# EAGLE board v0a (EAGLE 9.3.0)
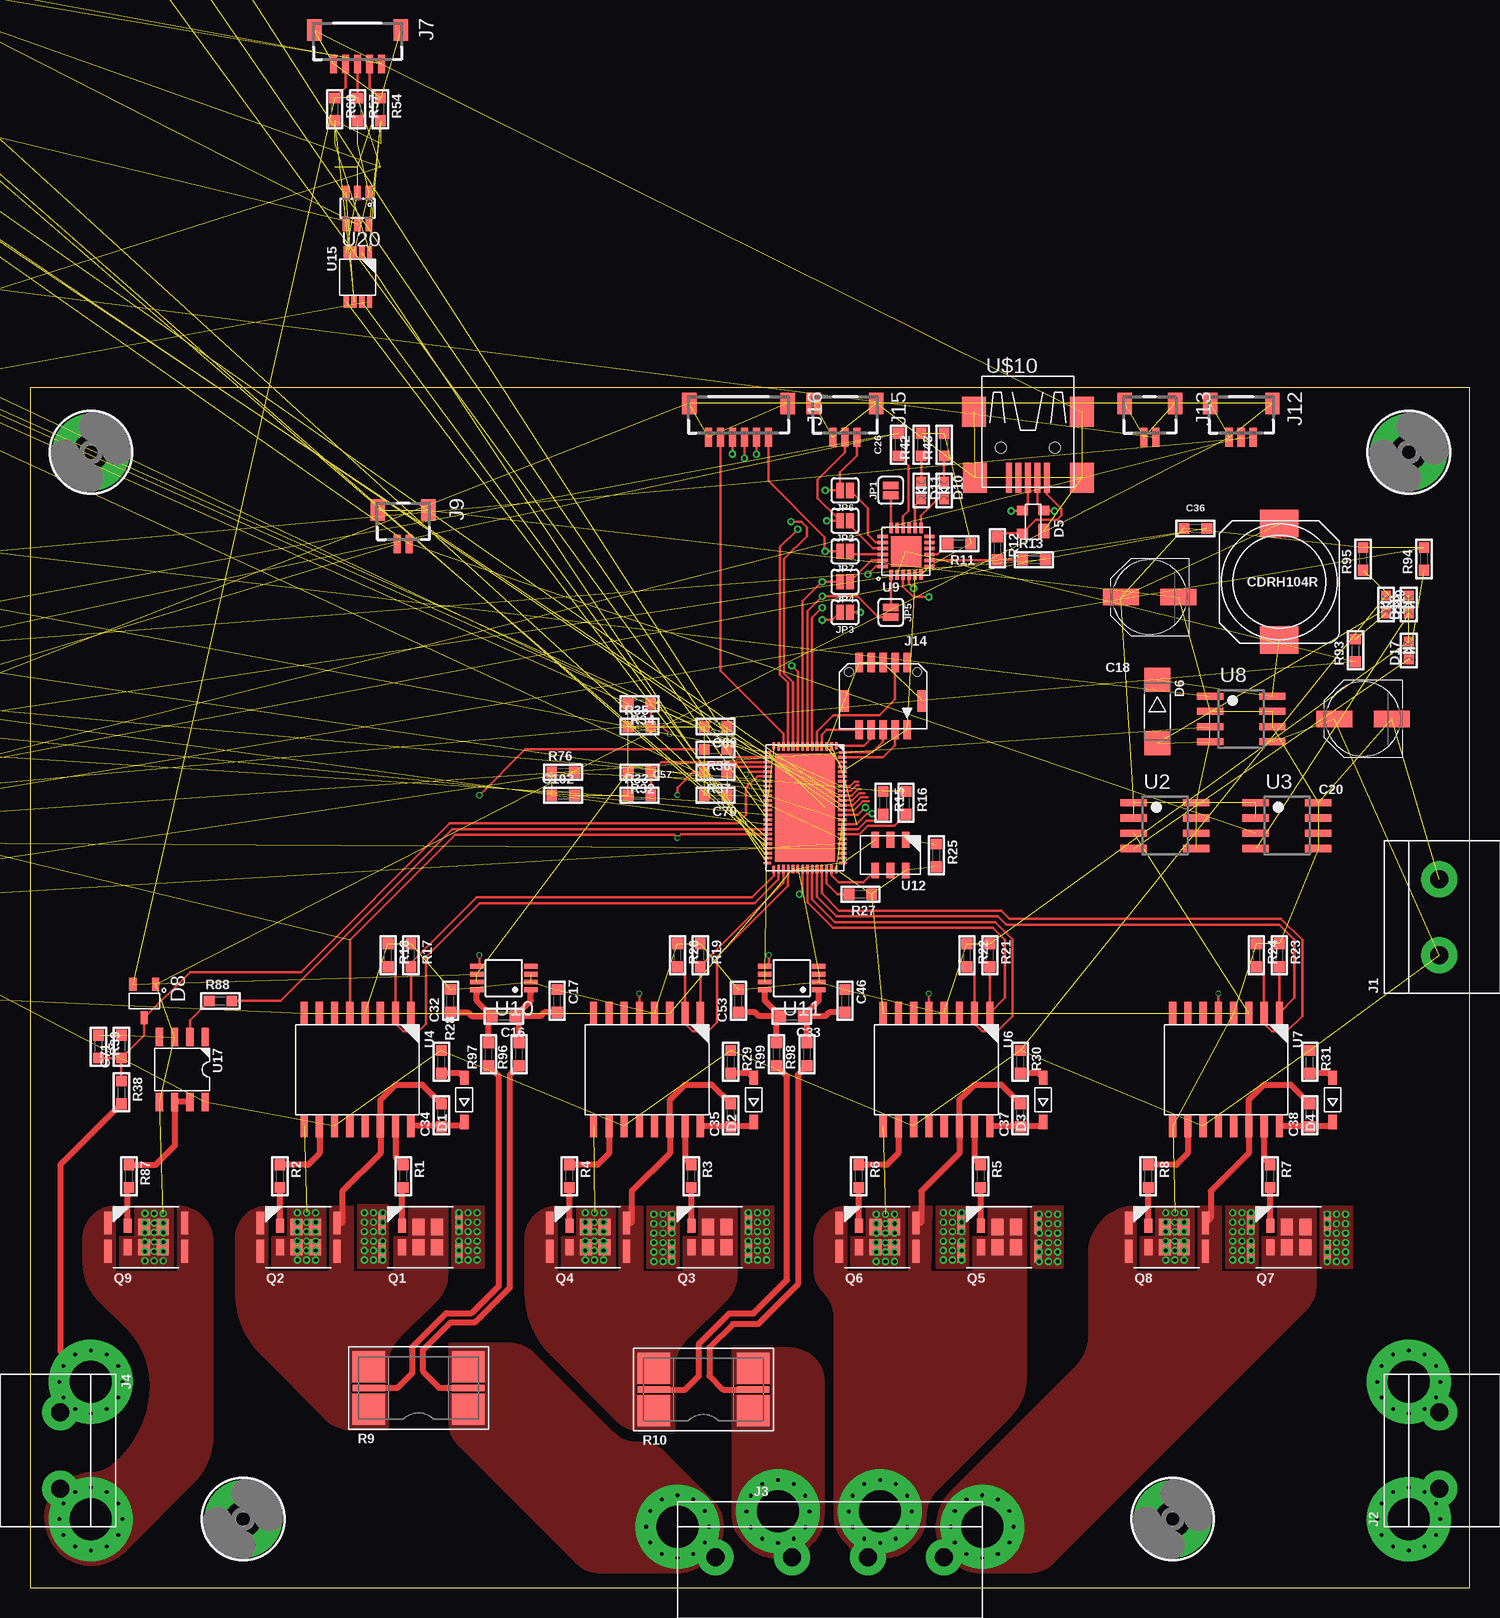
[diagram p5: board, top side]
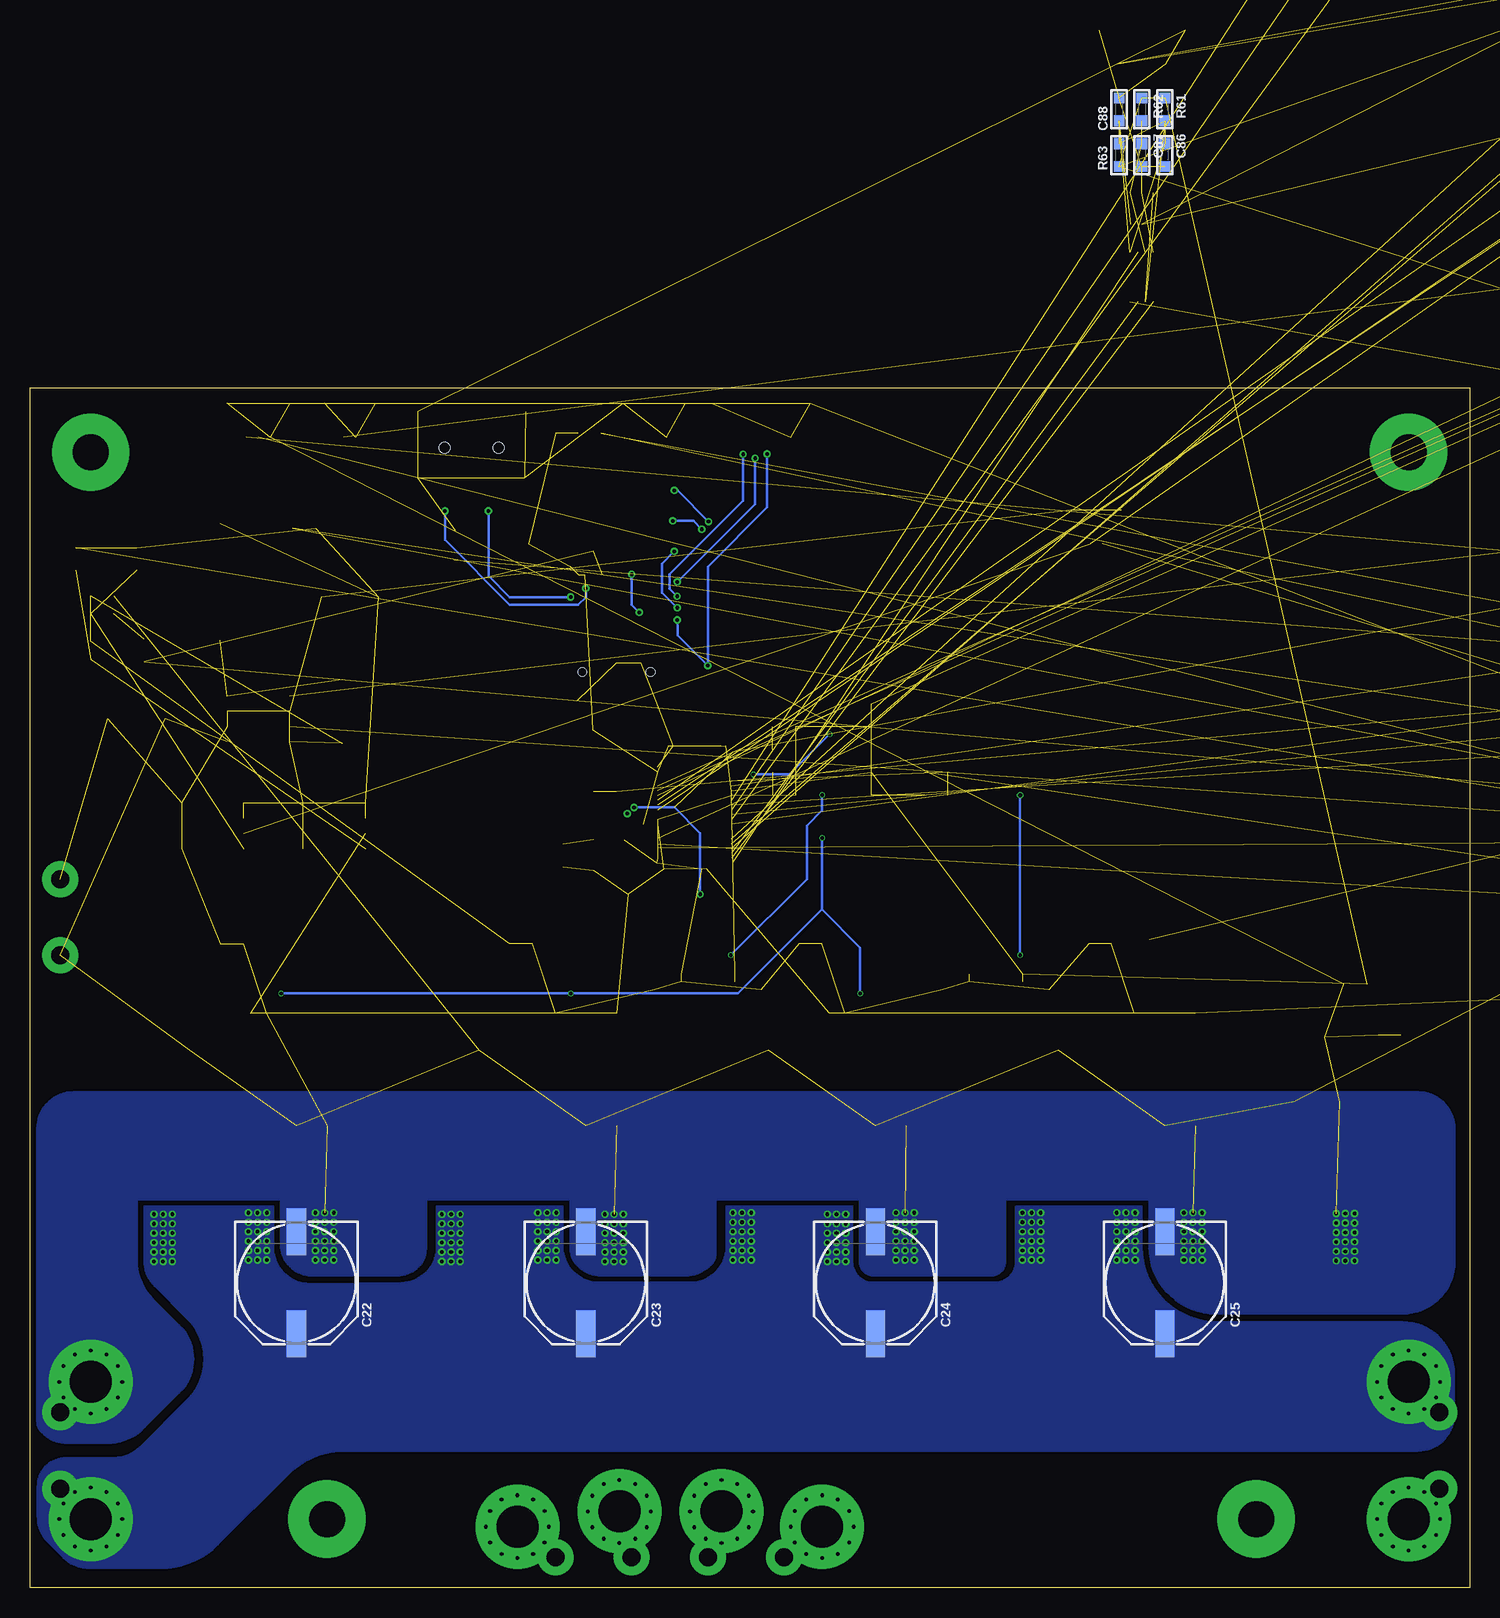
[diagram p6: board, bottom side, seen from below]

Size 120 x 100 mm. Coordinates in mm from the lower left corner, seen from the top.
Outline: 0,0 120,0 120,100 0,100 0,0
Copper layers (1*16): Top 0.035mm / dielectric 1.5mm / Bottom 0.035mm
Design rules "mask_vias *": minimum track width 5mil, minimum drill 0.3mm, track to track 5mil, track to pad 5mil, pad to pad 5mil, via to via 5mil, smd to smd 5mil, copper to edge 0.4mm, drill to drill 5mil, minimum pad ring 3mil, minimum via ring 3mil, stop-mask expansion 4mil, vias tented up to drill 0.8mm, thermal gap 10mil

## Footprints (pad centres in the part's own frame; a part is rotated, then mirrored left to right if it is on the bottom)
0603_WAVE = smd 0.9 x 0.9: P$1 -0.95,0; P$2 0.95,0
PANASONIC_D = smd 3 x 1.4: + 2.4,0; - -2.4,0
PANASONIC_G = smd 3.9 x 1.6: + 4.25,0; - -4.25,0
SOD-123 = smd 1.2 x 0.7: A 1.85,0; C -1.85,0
SOT143 = smd 1.2 x 0.9: 1 -0.711,-0.889 | smd 0.8 x 0.9: 2 0.989,-0.889; 3 0.989,0.911; 4 -0.911,0.911
DO214AA = smd 2 x 2.2: A 2.65,0; C -2.65,0
SOT-23-3 = smd 0.6 x 1.1: P$1 -0.95,-1.4; P$2 0.95,-1.4; P$3 0,1.4
CHIPLED_0603 = smd 0.8 x 0.8: A 0,-0.75; C 0,0.75
2P-6.35P = drill 1.5 pad 3: 1 -3.175,0; 2 3.175,0
4P-6.35P = drill 1.5 pad 3: 1 -9.525,0; 2 -3.175,0; 3 3.175,0; 4 9.525,0
SM05B-SSR-H-TB = smd 0.6 x 1.55: 1 -2,1.925; 2 -1,1.925; 3 0,1.925; 4 1,1.925; 5 2,1.925 | smd 1.2 x 1.8: FIT@1 -3.6,-0.9; FIT@2 3.6,-0.9
SM02B-SSR-H-TB = smd 0.6 x 1.55: 1 -0.5,1.925; 2 0.5,1.925 | smd 1.2 x 1.8: FIT@1 -2.1,-0.9; FIT@2 2.1,-0.9
SM03B-SSR-H-TB = smd 0.6 x 1.55: 1 -1,1.925; 2 0,1.925; 3 1,1.925 | smd 1.2 x 1.8: FIT@1 -2.6,-0.9; FIT@2 2.6,-0.9
F20F-10DP-1V = smd 0.6 x 1.6: 1 -2,2.8; 2 -2,-2.8; 3 -1,2.8; 4 -1,-2.8; 5 0,2.8; 6 0,-2.8; 7 1,2.8; 8 1,-2.8; 9 2,2.8; 10 2,-2.8 | smd 0.85 x 1.8: TAB1 -3.275,0.4; TAB2 3.275,0.4 | hole 0.7: -2.85,-2.005; 2.85,-2.005
SM06B-SSR-H-TB = smd 0.6 x 1.55: 1 -2.5,1.925; 2 -1.5,1.925; 3 -0.5,1.925; 4 0.5,1.925; 5 1.5,1.925; 6 2.5,1.925 | smd 1.2 x 1.8: FIT@1 -4.1,-0.9; FIT@2 4.1,-0.9
SMT-JUMPER_2_NC_PASTE_SILK = smd 0.635 x 1.27: 1 -0.406,0; 2 0.406,0
SMT-JUMPER_2_NO_SILK = smd 0.635 x 1.27: 1 -0.406,0; 2 0.406,0
CDRH104R = smd 3.2 x 2.3: 1 0,-4.85; 2 0,4.85
TH-HP = drill 0.3: H1 2.625,0; H2 2.273,1.312; H3 1.312,2.273; H4 0,2.625; H5 -1.312,2.273; H6 -2.273,1.312; H7 -2.625,0; H8 -2.273,-1.312; H9 -1.312,-2.273; H10 0,-2.625; H11 1.312,-2.273; H12 2.273,-1.312 | drill 3.5 pad 7: PAD 0,0
DIRECTFET-ME = smd 0.6 x 1.9: D1 -3.025,1.175; D2 -3.025,-1.175; D3 3.375,-1.175; D4 3.375,1.175 | smd 0.65 x 1.15: G -1.375,0.95 | smd 0.65 x 1.35: S1 -1.375,-0.85 | smd 1 x 1.35: S2 0,-0.85; S3 1.55,-0.85; S4 1.55,0.85; S5 0,0.85
3920 = smd 2.7 x 2.592: 1 -4.15,1.778; 2 -4.15,-1.778; 3 4.15,-1.778; 4 4.15,1.778 | smd 2.7 x 0.508: SENSE+ -4.15,0; SENSE- 4.15,0
QFN76 = smd 0.6 x 0.225: 1 -5.15,2.6; 14 -5.15,-2.6; 39 5.15,-2.6; 52 5.15,2.6 | smd 0.7 x 0.225: 2 -5.1,2.2; 3 -5.1,1.8; 4 -5.1,1.4; 5 -5.1,1; 6 -5.1,0.6; 7 -5.1,0.2; 8 -5.1,-0.2; 9 -5.1,-0.6; 10 -5.1,-1; 11 -5.1,-1.4; 12 -5.1,-1.8; 13 -5.1,-2.2; 40 5.1,-2.2; 41 5.1,-1.8; 42 5.1,-1.4; 43 5.1,-1; 44 5.1,-0.6; 45 5.1,-0.2; 46 5.1,0.2; 47 5.1,0.6; 48 5.1,1; 49 5.1,1.4; 50 5.1,1.8; 51 5.1,2.2 | smd 0.225 x 0.6: 15 -4.6,-3.15; 38 4.6,-3.15; 53 4.6,3.15; 76 -4.6,3.15 | smd 0.225 x 0.7: 16 -4.2,-3.1; 17 -3.8,-3.1; 18 -3.4,-3.1; 19 -3,-3.1; 20 -2.6,-3.1; 21 -2.2,-3.1; 22 -1.8,-3.1; 23 -1.4,-3.1; 24 -1,-3.1; 25 -0.6,-3.1; 26 -0.2,-3.1; 27 0.2,-3.1; 28 0.6,-3.1; 29 1,-3.1; 30 1.4,-3.1; 31 1.8,-3.1; 32 2.2,-3.1; 33 2.6,-3.1; 34 3,-3.1; 35 3.4,-3.1; 36 3.8,-3.1; 37 4.2,-3.1; 54 4.2,3.1; 55 3.8,3.1; 56 3.4,3.1; 57 3,3.1; 58 2.6,3.1; 59 2.2,3.1; 60 1.8,3.1; 61 1.4,3.1; 62 1,3.1; 63 0.6,3.1; 64 0.2,3.1; 65 -0.2,3.1; 66 -0.6,3.1; 67 -1,3.1; 68 -1.4,3.1; 69 -1.8,3.1; 70 -2.2,3.1; 71 -2.6,3.1; 72 -3,3.1; 73 -3.4,3.1; 74 -3.8,3.1; 75 -4.2,3.1 | smd 9 x 5: PAD 0,0
SOIC8 = smd 0.6 x 2.2: 1 -1.905,-2.6; 2 -0.635,-2.6; 3 0.635,-2.6; 4 1.905,-2.6; 5 1.905,2.6; 6 0.635,2.6; 7 -0.635,2.6; 8 -1.905,2.6
SOIC-16-WB = smd 0.6 x 1.9: 1 -4.445,-4.7; 2 -3.175,-4.7; 3 -1.905,-4.7; 4 -0.635,-4.7; 5 0.635,-4.7; 6 1.905,-4.7; 7 3.175,-4.7; 8 4.445,-4.7; 9 4.445,4.7; 10 3.175,4.7; 11 1.905,4.7; 12 0.635,4.7; 13 -0.635,4.7; 14 -1.905,4.7; 15 -3.175,4.7; 16 -4.445,4.7
QFN24 = smd 0.3 x 0.85: 1 -1.25,-1.95; 2 -0.75,-1.95; 3 -0.25,-1.95; 4 0.25,-1.95; 5 0.75,-1.95; 6 1.25,-1.95; 13 1.25,1.95; 14 0.75,1.95; 15 0.25,1.95; 16 -0.25,1.95; 17 -0.75,1.95; 18 -1.25,1.95 | smd 0.85 x 0.3: 7 1.95,-1.25; 8 1.95,-0.75; 9 1.95,-0.25; 10 1.95,0.25; 11 1.95,0.75; 12 1.95,1.25; 19 -1.95,1.25; 20 -1.95,0.75; 21 -1.95,0.25; 22 -1.95,-0.25; 23 -1.95,-0.75; 24 -1.95,-1.25 | smd 2.55 x 2.55: PAD 0,0
MSOP-8 = smd 0.4 x 1.1: 1 -0.975,-2.25; 2 -0.325,-2.25; 3 0.325,-2.25; 4 0.975,-2.25; 5 0.975,2.25; 6 0.325,2.25; 7 -0.325,2.25; 8 -0.975,2.25
CDFN_5X3.2 = smd 1.3 x 0.64: 1 -1.277,1.27; 2 -1.277,0; 3 -1.277,-1.27; 4 1.277,-1.27; 5 1.277,0; 6 1.277,1.27
TSSOP-8 = smd 0.45 x 1: 1 -1.005,-2.081; 2 -0.355,-2.081; 3 0.295,-2.081; 4 0.945,-2.081; 5 0.945,2.081; 6 0.295,2.081; 7 -0.355,2.081; 8 -1.005,2.081
SOIC_8 = smd 0.6 x 1.55: 1 -1.905,-2.7; 2 -0.635,-2.7; 3 0.635,-2.7; 4 1.905,-2.7; 5 1.905,2.7; 6 0.635,2.7; 7 -0.635,2.7; 8 -1.905,2.7
SOT23-6 = smd 0.55 x 1.2: 1 -0.95,-1.3; 2 0,-1.3; 3 0.95,-1.3; 4 0.95,1.3; 5 0,1.3; 6 -0.95,1.3
USB-M-S1 = smd 2.5 x 0.5: D+ 2.75,0; D- 2.75,0.8; GND 2.75,-1.6; ID 2.75,-0.8; VBUS 2.75,1.6 | smd 2.5 x 2: GND@1 -2.75,-4.5; GND@2 -2.75,4.5; GND@3 2.75,-4.4; GND@4 2.75,4.5 | hole 0.9: 0.25,2.25; 0.25,-2.25
MOUNTINGHOLE_3.0_PLATED = drill 3 pad 6.452: P$1 0,0

## Placement (x,y rotation side)
C1  [0603_WAVE]  not placed on the board
C2  [0603_WAVE]  not placed on the board
C3  [0603_WAVE]  not placed on the board
C4  [0603_WAVE]  not placed on the board
C5  [0603_WAVE]  not placed on the board
C6  [0603_WAVE]  not placed on the board
C7  [0603_WAVE]  not placed on the board
C8  [0603_WAVE]  not placed on the board
C9  100n  [0603_WAVE]  not placed on the board
C10  100n  [0603_WAVE]  not placed on the board
C11  470n  [0603_WAVE]  not placed on the board
C12  4u7  [0603_WAVE]  not placed on the board
C13  [0603_WAVE]  not placed on the board
C14  4u7  [0603_WAVE]  not placed on the board
C15  4u7  [0603_WAVE]  not placed on the board
C16  100n  [0603_WAVE]  39.5,47.62 180 top
C17  100n  [0603_WAVE]  43.94,48.9 270 top
C18  100u  [PANASONIC_D]  93.34,82.55 180 top
C19  10u 25v  [0603_WAVE]  not placed on the board
C20  100u  [PANASONIC_D]  111.12,72.39 180 top
C21  4u7  [0603_WAVE]  not placed on the board
C22  330u  [PANASONIC_G]  97.79,25.4 270 bottom
C23  330u  [PANASONIC_G]  73.66,25.4 270 bottom
C24  330u  [PANASONIC_G]  49.53,25.4 270 bottom
C25  330u  [PANASONIC_G]  25.4,25.4 270 bottom
C26  4u7  [0603_WAVE]  72.39,95.25 90 top
C27  100n 25v  [0603_WAVE]  not placed on the board
C28  100n  [0603_WAVE]  not placed on the board
C29  100n  [0603_WAVE]  not placed on the board
C30  4u7  [0603_WAVE]  not placed on the board
C31  [0603_WAVE]  not placed on the board
C32  100n  [0603_WAVE]  35.05,48.9 90 top
C33  100n  [0603_WAVE]  63.5,47.62 180 top
C34  220n 25v  [0603_WAVE]  34.29,39.37 90 top
C35  220n 25v  [0603_WAVE]  58.42,39.37 90 top
C36  4u7  [0603_WAVE]  97.16,88.27 0 top
C37  220n 25v  [0603_WAVE]  82.55,39.37 90 top
C38  220n 25v  [0603_WAVE]  106.68,39.37 90 top
C39  10u 25v  [0603_WAVE]  not placed on the board
C40  100n  [0603_WAVE]  not placed on the board
C41  100n  [0603_WAVE]  not placed on the board
C42  100n  [0603_WAVE]  not placed on the board
C43  10u 25v  [0603_WAVE]  not placed on the board
C44  10u 25v  [0603_WAVE]  not placed on the board
C45  4u7  [0603_WAVE]  not placed on the board
C46  100n  [0603_WAVE]  67.94,48.9 270 top
C47  100n  [0603_WAVE]  not placed on the board
C48  100n 25v  [0603_WAVE]  not placed on the board
C49  100n 25v  [0603_WAVE]  not placed on the board
C50  10u 25v  [0603_WAVE]  not placed on the board
C51  10u 25v  [0603_WAVE]  not placed on the board
C52  4u7  [0603_WAVE]  not placed on the board
C53  100n  [0603_WAVE]  59.05,48.9 90 top
C54  100n  [0603_WAVE]  not placed on the board
C55  100n 25v  [0603_WAVE]  not placed on the board
C56  100n 25v  [0603_WAVE]  not placed on the board
C57  10u 25v  [0603_WAVE]  not placed on the board
C58  10u 25v  [0603_WAVE]  not placed on the board
C59  4u7  [0603_WAVE]  not placed on the board
C61  100n  [0603_WAVE]  not placed on the board
C62  100n 25v  [0603_WAVE]  not placed on the board
C63  100n 25v  [0603_WAVE]  not placed on the board
C64  10u 25v  [0603_WAVE]  not placed on the board
C66  4u7  [0603_WAVE]  not placed on the board
C67  100n  [0603_WAVE]  not placed on the board
C68  100n  [0603_WAVE]  not placed on the board
C69  100p  [0603_WAVE]  57.15,71.75 180 top
C70  100p  [0603_WAVE]  57.15,66.04 180 top
C71  10n  [0603_WAVE]  7.62,45.09 90 top
C76  100p  [0603_WAVE]  not placed on the board
C77  100p  [0603_WAVE]  not placed on the board
C78  [0603_WAVE]  not placed on the board
C79  [0603_WAVE]  not placed on the board
C80  [0603_WAVE]  not placed on the board
C81  [0603_WAVE]  not placed on the board
C82  [0603_WAVE]  not placed on the board
C83  [0603_WAVE]  not placed on the board
C84  [0603_WAVE]  not placed on the board
C85  1u  [0603_WAVE]  not placed on the board
C86  [0603_WAVE]  not placed on the board
C87  [0603_WAVE]  not placed on the board
C88  [0603_WAVE]  not placed on the board
C89  [0603_WAVE]  not placed on the board
C90  100n  [0603_WAVE]  not placed on the board
C91  100n  [0603_WAVE]  not placed on the board
C92  100n  [0603_WAVE]  not placed on the board
C93  100n  [0603_WAVE]  not placed on the board
C94  100n  [0603_WAVE]  not placed on the board
C95  100n  [0603_WAVE]  not placed on the board
C96  [0603_WAVE]  not placed on the board
C97  [0603_WAVE]  not placed on the board
C98  [0603_WAVE]  not placed on the board
C99  [0603_WAVE]  not placed on the board
C100  100n  [0603_WAVE]  not placed on the board
C101  100n  [0603_WAVE]  not placed on the board
C102  100p  [0603_WAVE]  44.45,66.04 0 top
C103  100p  [0603_WAVE]  not placed on the board
C104  [0603_WAVE]  not placed on the board
C105  [0603_WAVE]  not placed on the board
C106  [0603_WAVE]  not placed on the board
C107  [0603_WAVE]  not placed on the board
D1  DSK24  [SOD-123]  36.2,40.64 90 top
D2  DSK24  [SOD-123]  60.33,40.64 90 top
D3  DSK24  [SOD-123]  84.45,40.64 90 top
D4  DSK24  [SOD-123]  108.58,40.64 90 top
D5  SP0503BAHT  [SOT143]  83.63,88.77 90 top
D6  SK54L  [DO214AA]  93.98,73.03 270 top
D8  BAT54S  [SOT-23-3]  9.53,48.9 180 top
D9  BAT54S  [SOT-23-3]  not placed on the board
D10  [CHIPLED_0603]  76.2,91.44 180 top
D11  [CHIPLED_0603]  74.3,91.44 180 top
D12  BAT54S  [SOT-23-3]  not placed on the board
D13  BAT54S  [SOT-23-3]  not placed on the board
D14  BAT54S  [SOT-23-3]  not placed on the board
D15  BAT54S  [SOT-23-3]  not placed on the board
D16  BAT54S  [SOT-23-3]  not placed on the board
D17  [CHIPLED_0603]  114.94,78.11 0 top
D18  [CHIPLED_0603]  114.94,81.92 0 top
D19  [CHIPLED_0603]  113.03,81.92 180 top
J1  2P-6.35P  [2P-6.35P]  117.47,55.88 90 top
J2  2P-6.35P  [2P-6.35P]  117.47,11.43 90 top
J3  4P-6.35P  [4P-6.35P]  66.67,2.54 0 top
J4  2P-6.35P  [2P-6.35P]  2.54,11.43 270 top
J5  SH-5  [SM05B-SSR-H-TB]  not placed on the board
J6  SH-5  [SM05B-SSR-H-TB]  not placed on the board
J7  SH-5  [SM05B-SSR-H-TB]  27.3,128.91 180 top  (outside the outline)
J8  SH-5  [SM05B-SSR-H-TB]  not placed on the board
J9  SH-2  [SM02B-SSR-H-TB]  31.11,88.9 180 top
J10  SH-5  [SM05B-SSR-H-TB]  not placed on the board
J12  SH-3  [SM03B-SSR-H-TB]  100.97,97.79 180 top
J13  SH-2  [SM02B-SSR-H-TB]  93.34,97.79 180 top
J14  F20F-10DP-1V  [F20F-10DP-1V]  71.12,74.3 180 top
J15  SH-3  [SM03B-SSR-H-TB]  67.94,97.79 180 top
J16  SH-6  [SM06B-SSR-H-TB]  59.05,97.79 180 top
JP1  JUMPER-SMT_2_NC_PASTE_SILK  [SMT-JUMPER_2_NC_PASTE_SILK]  71.75,91.44 90 top
JP2  JUMPER-SMT_2_NO_SILK  [SMT-JUMPER_2_NO_SILK]  67.94,88.9 180 top
JP3  JUMPER-SMT_2_NC_PASTE_SILK  [SMT-JUMPER_2_NC_PASTE_SILK]  67.94,81.28 180 top
JP4  JUMPER-SMT_2_NC_PASTE_SILK  [SMT-JUMPER_2_NC_PASTE_SILK]  67.94,83.82 180 top
JP5  JUMPER-SMT_2_NC_PASTE_SILK  [SMT-JUMPER_2_NC_PASTE_SILK]  71.75,81.28 270 top
JP6  JUMPER-SMT_2_NO_SILK  [SMT-JUMPER_2_NO_SILK]  67.94,91.44 180 top
JP7  JUMPER-SMT_2_NC_PASTE_SILK  [SMT-JUMPER_2_NC_PASTE_SILK]  67.94,86.36 180 top
L2  68uH  [CDRH104R]  104.14,83.82 0 top
P1  POWPAD  [TH-HP]  53.98,5.08 90 top
P2  POWPAD  [TH-HP]  62.36,6.35 90 top
P3  POWPAD  [TH-HP]  70.87,6.35 90 top
P4  POWPAD  [TH-HP]  79.38,5.08 90 top
P5  POWPAD  [TH-HP]  114.94,17.14 0 top
P6  POWPAD  [TH-HP]  114.94,5.71 0 top
P7  POWPAD  [TH-HP]  5.08,17.14 0 top
P8  POWPAD  [TH-HP]  5.08,5.71 0 top
Q1  IRF7580  [DIRECTFET-ME]  32.38,29.21 0 top
Q2  IRF7580  [DIRECTFET-ME]  22.23,29.21 0 top
Q3  IRF7580  [DIRECTFET-ME]  56.52,29.21 0 top
Q4  IRF7580  [DIRECTFET-ME]  46.35,29.21 0 top
Q5  IRF7580  [DIRECTFET-ME]  80.64,29.21 0 top
Q6  IRF7580  [DIRECTFET-ME]  70.48,29.21 0 top
Q7  IRF7580  [DIRECTFET-ME]  104.78,29.21 0 top
Q8  IRF7580  [DIRECTFET-ME]  94.61,29.21 0 top
Q9  IRF7580  [DIRECTFET-ME]  9.53,29.21 0 top
R1  2.2  [0603_WAVE]  31.11,34.29 270 top
R2  2.2  [0603_WAVE]  20.83,34.29 270 top
R3  2.2  [0603_WAVE]  55.12,34.29 270 top
R4  2.2  [0603_WAVE]  44.96,34.29 270 top
R5  2.2  [0603_WAVE]  79.25,34.29 270 top
R6  2.2  [0603_WAVE]  69.09,34.29 270 top
R7  2.2  [0603_WAVE]  103.38,34.29 270 top
R8  2.2  [0603_WAVE]  93.22,34.29 270 top
R9  700u  [3920]  32.38,16.64 0 top
R10  700u  [3920]  56.13,16.51 0 top
R11  10k  [0603_WAVE]  77.47,87 180 top
R12  24k  [0603_WAVE]  80.64,86.61 270 top
R13  47k  [0603_WAVE]  83.69,85.66 0 top
R15  10k  [0603_WAVE]  71.12,65.41 270 top
R16  10k  [0603_WAVE]  73.03,65.41 270 top
R17  10k  [0603_WAVE]  31.75,52.7 270 top
R18  10k  [0603_WAVE]  29.84,52.7 270 top
R19  10k  [0603_WAVE]  55.88,52.7 270 top
R20  10k  [0603_WAVE]  53.98,52.7 270 top
R21  10k  [0603_WAVE]  80.01,52.7 270 top
R22  10k  [0603_WAVE]  78.11,52.7 270 top
R23  10k  [0603_WAVE]  104.14,52.7 270 top
R24  10k  [0603_WAVE]  102.23,52.7 270 top
R25  [0603_WAVE]  75.56,61.02 270 top
R26  10k  [0603_WAVE]  not placed on the board
R27  [0603_WAVE]  69.22,57.78 180 top
R28  2.2  [0603_WAVE]  34.29,43.81 270 top
R29  2.2  [0603_WAVE]  58.42,43.81 270 top
R30  2.2  [0603_WAVE]  82.55,43.81 270 top
R31  2.2  [0603_WAVE]  106.68,43.81 270 top
R32  10k  [0603_WAVE]  50.8,67.94 180 top
R33  10k  [0603_WAVE]  50.8,66.04 0 top
R34  10k  [0603_WAVE]  50.8,73.66 180 top
R35  10k  [0603_WAVE]  50.8,71.75 0 top
R36  100  [0603_WAVE]  57.15,69.85 180 top
R37  100  [0603_WAVE]  57.15,67.94 180 top
R38  140k  [0603_WAVE]  7.62,41.27 270 top
R39  10k  [0603_WAVE]  5.71,45.09 270 top
R40  24k  [0603_WAVE]  not placed on the board
R41  24k  [0603_WAVE]  not placed on the board
R42  [0603_WAVE]  74.3,95.25 90 top
R43  [0603_WAVE]  76.2,95.25 90 top
R45  10k  [0603_WAVE]  not placed on the board
R46  10k  [0603_WAVE]  not placed on the board
R47  10k  [0603_WAVE]  not placed on the board
R48  [0603_WAVE]  not placed on the board
R49  [0603_WAVE]  not placed on the board
R50  [0603_WAVE]  not placed on the board
R51  [0603_WAVE]  not placed on the board
R52  [0603_WAVE]  not placed on the board
R53  [0603_WAVE]  not placed on the board
R54  [0603_WAVE]  29.21,123.19 270 top  (outside the outline)
R55  10M  [0603_WAVE]  not placed on the board
R56  10k  [0603_WAVE]  not placed on the board
R57  [0603_WAVE]  27.3,123.19 270 top  (outside the outline)
R58  4.2k  [0603_WAVE]  not placed on the board
R59  1.2k  [0603_WAVE]  not placed on the board
R60  [0603_WAVE]  25.4,123.19 270 top  (outside the outline)
R61  100k  [0603_WAVE]  not placed on the board
R62  100k  [0603_WAVE]  not placed on the board
R63  100k  [0603_WAVE]  not placed on the board
R64  100k  [0603_WAVE]  not placed on the board
R65  100k  [0603_WAVE]  not placed on the board
R66  100k  [0603_WAVE]  not placed on the board
R67  100k  [0603_WAVE]  not placed on the board
R68  100k  [0603_WAVE]  not placed on the board
R69  100k  [0603_WAVE]  not placed on the board
R70  [0603_WAVE]  not placed on the board
R71  [0603_WAVE]  not placed on the board
R72  [0603_WAVE]  not placed on the board
R73  100k  [0603_WAVE]  not placed on the board
R74  100k  [0603_WAVE]  not placed on the board
R75  100k  [0603_WAVE]  not placed on the board
R76  100  [0603_WAVE]  44.45,67.94 0 top
R77  100  [0603_WAVE]  not placed on the board
R78  10k  [0603_WAVE]  not placed on the board
R79  10k  [0603_WAVE]  not placed on the board
R80  10k  [0603_WAVE]  not placed on the board
R81  10k  [0603_WAVE]  not placed on the board
R82  10k  [0603_WAVE]  not placed on the board
R83  10k  [0603_WAVE]  not placed on the board
R84  [0603_WAVE]  not placed on the board
R85  [0603_WAVE]  not placed on the board
R86  [0603_WAVE]  not placed on the board
R87  2.2  [0603_WAVE]  8.26,34.29 270 top
R88  220  [0603_WAVE]  15.88,48.9 0 top
R89  24k  [0603_WAVE]  not placed on the board
R90  24k  [0603_WAVE]  not placed on the board
R91  24k  [0603_WAVE]  not placed on the board
R92  24k  [0603_WAVE]  not placed on the board
R93  2k  [0603_WAVE]  110.49,78.11 90 top
R94  1k  [0603_WAVE]  116.2,85.72 90 top
R95  1k  [0603_WAVE]  111.12,85.72 90 top
R96  [0603_WAVE]  40.77,44.45 90 top
R97  [0603_WAVE]  38.23,44.45 90 top
R98  [0603_WAVE]  64.77,44.45 90 top
R99  [0603_WAVE]  62.23,44.45 90 top
U1  TMC4671  [QFN76]  64.61,65 270 top
U2  MIC39101  [SOIC8]  94.61,63.5 270 top
U3  MIC39101  [SOIC8]  104.78,63.5 270 top
U4  SI82397  [SOIC-16-WB]  27.3,43.18 180 top
U5  SI82397  [SOIC-16-WB]  51.44,43.18 180 top
U6  SI82397  [SOIC-16-WB]  75.56,43.18 180 top
U7  SI82397  [SOIC-16-WB]  99.69,43.18 180 top
U8  MIC4682  [SOIC8]  100.97,72.39 270 top
U9  CP2130/2102N  [QFN24]  73.03,86.36 0 top
U10  AD8418A  [MSOP-8]  39.5,50.8 90 top
U11  AD8418A  [MSOP-8]  63.5,50.8 90 top
U12  DSC1101  [CDFN_5X3.2]  71.73,61.05 270 top
U13  74LVC3G17  [TSSOP-8]  not placed on the board
U14  74LVC3G17  [TSSOP-8]  not placed on the board
U15  74LVC3G17  [TSSOP-8]  not placed on the board
U16  74LVC3G17  [TSSOP-8]  not placed on the board
U17  SI8261  [SOIC_8]  12.7,43.18 180 top
U18  SRV05-4  [SOT23-6]  not placed on the board
U19  SRV05-4  [SOT23-6]  not placed on the board
U20  SRV05-4  [SOT23-6]  not placed on the board
U21  SRV05-4  [SOT23-6]  not placed on the board
U$10  USB-SHIELD  [USB-M-S1]  83.19,95.25 270 top
U$12  MOUNTINGHOLE3.0  [MOUNTINGHOLE_3.0_PLATED]  114.94,94.61 0 top
U$13  MOUNTINGHOLE3.0  [MOUNTINGHOLE_3.0_PLATED]  5.08,94.61 0 top
U$15  MOUNTINGHOLE3.0  [MOUNTINGHOLE_3.0_PLATED]  95.25,5.71 0 top
U$16  MOUNTINGHOLE3.0  [MOUNTINGHOLE_3.0_PLATED]  17.78,5.71 0 top

## Tracks (layer width: path | path; a pad name or v marks a point on that pad's centre or on a via)
1.8V  (via drill 0.3 pad 0.6)  (4 unrouted)
  Top 0.2: U1.45 64.41,58.05 v64.14,57.78 | v69.64,65.01 69.03,64.4 U1.63
  Bottom 0.2: v64.14,57.78 64.14,62.87 66.28,65.01 v69.64,65.01
3.3V  (via drill 0.3 pad 0.6)  (56 unrouted)
  Top 0.2: U1.61 68.88,63.6 69.77,64.49 69.86,64.49 69.88,64.5 v70.2,64.5
5V  (51 unrouted)
12V  (32 unrouted)
!CS  (via drill 0.3 pad 0.6)
  Top 0.2: U1.6 65.2,80.83 v66.04,81.66 | JP7.2 v66.29,86.36 66.25,86.4 66.25,87.53 61.55,92.22 J16.1
  Bottom 0.2: v66.29,86.36 67.31,85.34 67.31,82.91 66.06,81.66 v66.04,81.66
ADC_I0_U_PF  (via drill 0.3, 0.35)
  Top 0.2: R36.P$2 41.27,69.85 v37.47,66.04 | v37.47,52.7 37.47,51.99 U10.5
  Bottom 0.2: v37.47,66.04 v37.47,52.7
ADC_I1_V_PF  (via drill 0.3)
  Top 0.2: R37.P$2 55.24,67.94 53.98,66.67 v53.98,66.04 | v61.59,52.7 61.59,52.12 U11.5
  Bottom 0.2: v53.98,66.04 53.98,64.77 55.24,63.5 55.24,59.05 v61.59,52.7
ADC_T_MOSFETS  (3 unrouted)
ADC_T_MOTOR  (3 unrouted)
AENC_UX_P  (3 unrouted)
AENC_VN_P  (3 unrouted)
AENC_WY_P  (3 unrouted)
BRAKE
  Top 0.2: R88.P$2 20.89,48.9 35.19,63.2 U1.31
CP2102_RX  (via drill 0.3 pad 0.6)
  Top 0.2: J15.2 67.94,94.61 65.66,92.33 65.66,90.78 67.42,89.01 | 67.42,89.01 JP2.2 | v66.42,88.9 67.31,88.9 67.42,89.01 | v64.01,88.2 62.54,86.73 62.54,76.06 63.2,75.4 U1.11
  Bottom 0.2: v66.42,88.9 64.71,88.9 v64.01,88.2
CP2102_TX  (via drill 0.3 pad 0.6)
  Top 0.2: J15.1 68.94,94.34 67.54,92.94 JP6.2 v66.29,91.44 | U1.10 63.6,75.46 62.87,76.2 62.87,85.72 64.77,87.63 64.77,88.38 64.31,88.84 v63.44,88.84
  Bottom 0.2: v66.29,91.44 66.04,91.44 v63.44,88.84
D+  (via drill 0.3 pad 0.6)
  Top 0.2: U$10.D+ 83.19,90.23 D5.3 82.68,89.72 v81.79,89.72 | v74.93,82.55 v74.92,82.56 73.63,82.56 72.78,83.42 U9.3
  Bottom 0.2: v74.93,82.55 80.01,82.55 81.79,84.33 v81.79,89.72
D-  (via drill 0.3 pad 0.6)
  Top 0.2: U$10.D- 83.98,90.3 D5.2 84.56,89.72 v85.41,89.72 | U9.4 73.28,83.66 v73.66,83.28
  Bottom 0.2: v73.66,83.28 73.66,82.55 74.3,81.92 80.01,81.92 85.41,87.31 v85.41,89.72
DBG_SPI_MISO
  Top 0.2: J14.9 66.42,71.5 66,71.08 U1.4
DBG_SPI_MOSI
  Top 0.2: U1.1 69.52,70.15 70.12,70.75 J14.7
DBG_SPI_NSCS
  Top 0.2: U1.75 67.72,69.22 71.12,69.22 72.12,70.22 J14.3
DBG_SPI_SCK
  Top 0.2: U1.76 70.23,69.6 71.12,70.48 J14.5
DBG_SPI_TRG
  Top 0.2: J14.4 72.12,74.03 70.8,72.71 66.99,72.71 65.61,71.32 U1.5
DCBUS  (via drill 0.3 pad 0.6)
  Top 0.508: R38.P$2 2.54,35.24 2.54,19.68 P7.PAD
  other vias: 27.88,31.24 28.64,31.24 29.4,31.24 27.88,30.45 28.64,30.45 29.4,30.45 29.4,29.67 28.64,29.67 27.88,29.67 27.88,28.88 28.64,28.88 29.4,28.88 27.88,28.09 28.64,28.09 29.4,28.09 27.88,27.3 28.64,27.3 29.4,27.3 35.75,31.24 36.51,31.24 37.27,31.24 35.75,30.45 36.51,30.45 37.27,30.45 37.27,29.67 36.51,29.67 35.75,29.67 35.75,28.88 36.51,28.88 37.27,28.88 35.75,28.09 36.51,28.09 37.27,28.09 35.75,27.3 36.51,27.3 37.27,27.3 59.88,31.24 60.64,31.24 61.4,31.24 59.88,30.45 60.64,30.45 61.4,30.45 61.4,29.67 60.64,29.67 59.88,29.67 59.88,28.88 60.64,28.88 61.4,28.88 59.88,28.09 60.64,28.09 61.4,28.09 59.88,27.3 60.64,27.3 61.4,27.3 52.01,31.11 52.77,31.11 53.53,31.11 52.01,30.33 52.77,30.33 53.53,30.33 53.53,29.54 52.77,29.54 52.01,29.54 52.01,28.75 52.77,28.75 53.53,28.75 52.01,27.97 52.77,27.97 53.53,27.97 52.01,27.18 52.77,27.18 53.53,27.18 76.14,31.24 76.9,31.24 77.66,31.24 76.14,30.45 76.9,30.45 77.66,30.45 77.66,29.67 76.9,29.67 76.14,29.67 76.14,28.88 76.9,28.88 77.66,28.88 76.14,28.09 76.9,28.09 77.66,28.09 76.14,27.3 76.9,27.3 77.66,27.3 100.27,31.24 101.03,31.24 101.79,31.24 100.27,30.45 101.03,30.45 101.79,30.45 101.79,29.67 101.03,29.67 100.27,29.67 100.27,28.88 101.03,28.88 101.79,28.88 100.27,28.09 101.03,28.09 101.79,28.09 100.27,27.3 101.03,27.3 101.79,27.3 108.14,31.11 108.9,31.11 109.66,31.11 108.14,30.33 108.9,30.33 109.66,30.33 109.66,29.54 108.9,29.54 108.14,29.54 108.14,28.75 108.9,28.75 109.66,28.75 108.14,27.97 108.9,27.97 109.66,27.97 108.14,27.18 108.9,27.18 109.66,27.18 84.14,31.11 84.9,31.11 85.66,31.11 84.14,30.33 84.9,30.33 85.66,30.33 85.66,29.54 84.9,29.54 84.14,29.54 84.14,28.75 84.9,28.75 85.66,28.75 84.14,27.97 84.9,27.97 85.66,27.97 84.14,27.18 84.9,27.18 85.66,27.18
  pour Top (no thermals): 27.3,31.88 27.3,26.67 29.84,26.67 29.84,31.88
  pour Top (no thermals): 37.85,26.67 37.85,31.75 35.18,31.75 35.18,26.67
  pour Bottom (no thermals): 1.27,14.43 1.27,17.84 arc-90 5.54,22.11 21.01,22.11 arc90 27.3,28.4 27.3,31.75 37.85,31.75 37.85,27.14 arc90 39.57,25.41 49.69,25.39 arc90 51.42,27.13 51.42,31.75 61.98,31.75 61.98,28.4 arc90 64.98,25.4 72.56,25.4 arc90 75.56,28.4 75.56,31.75 86.11,31.75 86.11,28.37 arc89 89.08,25.37 96.67,25.3 arc91 99.69,28.3 99.69,31.75 110.49,31.75 110.49,27.28 arc-45 109.61,25.16 106.88,22.43 arc90 106.88,15.65 110.85,11.67 arc45 112.98,10.79 117.02,10.79 arc-90 119.38,8.43 119.38,5.94 arc-45 118.5,3.82 117.21,2.53 arc-45 115.09,1.65 109.07,1.65 arc-45 104.34,3.61 98.48,9.47 arc45 93.74,11.43 4.27,11.43 arc-90
  pour Top (no thermals): 99.69,31.75 99.69,26.67 102.36,26.67 102.36,31.75
  pour Top (no thermals): 75.56,31.75 75.56,26.67 78.23,26.67 78.23,31.75
  pour Top (no thermals): 61.98,26.67 61.98,31.75 59.31,31.75 59.31,26.67
  pour Top (no thermals): 51.44,31.75 51.44,26.67 54.1,26.67 54.1,31.75
  pour Top (no thermals): 110.24,26.67 110.24,31.75 107.57,31.75 107.57,26.67
  pour Top (no thermals): 86.11,26.67 86.11,31.75 83.44,31.75 83.44,26.67
DIR  (3 unrouted)
ENC2_A  (1 unrouted)
  Top 0.2: 69.94,65.55 69.77,65.55 69.76,65.54 69.42,65.54 68.68,64.8 U1.64
ENC2_B  (1 unrouted)
  Top 0.2: 69.81,65.88 69.63,65.88 69.62,65.87 69.29,65.87 68.62,65.2 U1.65
ENC2_N  (1 unrouted)
  Top 0.2: 69.55,66.2 69.5,66.2 69.49,66.19 69.15,66.19 68.56,65.6 U1.66
ENC_A  (1 unrouted)
ENC_B  (1 unrouted)
ENC_N  (1 unrouted)
ENO  (via drill 0.3)  (1 unrouted)
  Top 0.2: U1.32 54.29,62.8 v53.98,62.48 53.72,62.74 35.43,62.74 26.67,53.98 U4.5 | v50.8,49.53 U5.5 | v74.93,49.53 U6.5 | v99.06,49.53 U7.5
  Bottom 0.2: v53.98,62.48 53.98,56.52 | v99.06,49.53 v74.93,49.53 60.96,49.53 53.98,56.52 | 53.98,56.52 50.8,53.34 v50.8,49.53
GND  (via drill 0.3 pad 0.6)  (214 unrouted)
  other vias: 9.59,31.18 10.35,31.18 11.11,31.18 9.59,30.39 10.35,30.39 11.11,30.39 11.11,29.6 10.35,29.6 9.59,29.6 9.59,28.82 10.35,28.82 11.11,28.82 9.59,28.03 10.35,28.03 11.11,28.03 9.59,27.24 10.35,27.24 11.11,27.24 22.29,31.24 23.05,31.24 23.81,31.24 22.29,30.45 23.05,30.45 23.81,30.45 23.81,29.67 23.05,29.67 22.29,29.67 22.29,28.88 23.05,28.88 23.81,28.88 22.29,28.09 23.05,28.09 23.81,28.09 22.29,27.3 23.05,27.3 23.81,27.3 70.55,31.11 71.31,31.11 72.07,31.11 70.55,30.33 71.31,30.33 72.07,30.33 72.07,29.54 71.31,29.54 70.55,29.54 70.55,28.75 71.31,28.75 72.07,28.75 70.55,27.97 71.31,27.97 72.07,27.97 70.55,27.18 71.31,27.18 72.07,27.18 94.68,31.24 95.44,31.24 96.2,31.24 94.68,30.45 95.44,30.45 96.2,30.45 96.2,29.67 95.44,29.67 94.68,29.67 94.68,28.88 95.44,28.88 96.2,28.88 94.68,28.09 95.44,28.09 96.2,28.09 94.68,27.3 95.44,27.3 96.2,27.3 46.29,31.24 47.05,31.24 47.82,31.24 46.29,30.45 47.05,30.45 47.82,30.45 47.82,29.67 47.05,29.67 46.29,29.67 46.29,28.88 47.05,28.88 47.82,28.88 46.29,28.09 47.05,28.09 47.82,28.09 46.29,27.3 47.05,27.3 47.82,27.3
  pour Top (no thermals): 21.46,31.75 21.46,29.21 20.19,29.21 20.19,26.67 24.64,26.67 24.64,31.75
  pour Top (no thermals): 93.85,31.75 93.85,29.21 92.58,29.21 92.58,26.67 97.03,26.67 97.03,31.75
  pour Top (no thermals): 69.72,31.75 69.72,29.21 68.45,29.21 68.45,26.67 72.9,26.67 72.9,31.75
  pour Top (no thermals): 45.59,31.75 45.59,29.21 44.32,29.21 44.32,26.67 48.77,26.67 48.77,31.75
  pour Top (no thermals): 8.76,31.75 8.76,29.21 7.49,29.21 7.49,26.67 11.94,26.67 11.94,31.75
  pour Bottom (no thermals): 4.27,41.27 116.38,41.27 arc-90 119.38,38.27 119.38,13.89 arc-45 118.99,12.94 arc-45 116.87,12.06 113.64,12.06 arc-45 110.43,13.39 107.56,16.27 arc-45 106.41,19.05 arc-45 107.56,21.83 109.8,24.07 arc45 111.12,27.28 111.12,32.38 99.06,32.38 99.06,28.55 arc-45 98.32,26.77 arc-45 96.55,26.04 89.38,26.04 arc-45 87.6,26.77 arc-45 87,28.24 87,32.38 74.93,32.38 74.93,28.28 arc-45 74.33,26.83 arc-45 72.42,26.04 65.38,26.04 arc-45 63.26,26.91 arc-45 62.87,27.86 62.87,32.38 50.8,32.38 50.8,27.13 arc-90 49.7,26.04 39.83,26.04 arc-90 38.73,27.13 38.73,32.38 26.67,32.38 26.67,28.4 arc-90 21.13,22.86 5.54,22.86 arc-90 1.27,27.13 1.27,38.27 arc-90
HALL_UX  (1 unrouted)
HALL_V  (1 unrouted)
HALL_WY  (1 unrouted)
INT
  Top 0.2: U1.12 62.8,71.18 57.55,76.43 J16.5
MISO  (via drill 0.3 pad 0.6)
  Top 0.2: J16.4 v58.55,94.48 | U1.9 64,76.33 v63.5,76.83 | v66.04,80.64 66.9,80.64 JP3.2
  Bottom 0.2: v66.04,80.64 66.04,79.38 v63.5,76.83 63.5,85.09 58.55,90.03 v58.55,94.48
MOSI  (via drill 0.3 pad 0.6)
  Top 0.2: J16.3 v59.55,94.11 | U1.8 64.41,82.2 66.03,83.82 v66.04,83.82 JP4.2
  Bottom 0.2: v66.04,83.82 59.55,90.31 v59.55,94.11
N$3
  Top 0.508: U4.15 30.48,35.88 R1.P$1
N$4
  Top 0.508: Q2.G 20.85,33.29 arc45 R2.P$2
N$5  (9 unrouted)
N$6
  Top 0.508: R9.SENSE+ 30.61,16.64 31.88,17.91 31.88,20.07 34.7,22.89 36.81,22.89 39.09,25.17 39.09,42.63 R97.P$1
N$7
  Top 0.508: D1.C 35.88,38.48 34.29,38.48 | 34.29,38.48 U4.16 | C34.P$1 34.29,38.48
N$8
  Top 0.508: U5.15 54.61,35.75 R3.P$1
N$9
  Top 0.508: Q4.G 44.98,33.29 arc45 R4.P$2
N$10
  Top 0.508: R9.SENSE- 34.16,16.64 32.79,18.01 32.79,19.83 35.05,22.1 37.08,22.1 40.01,25.02 40.01,42.74 R96.P$1
N$11
  Top 0.508: U5.16 58.42,38.48 | 58.42,38.48 60.02,38.48 D2.C | C35.P$1 58.42,38.48
N$12
  Top 0.508: U6.15 78.74,35.75 R5.P$1
N$13
  Top 0.508: Q6.G 69.11,33.29 arc45 R6.P$2
N$14
  Top 0.2: 40.77,47.3 C16.P$1
  Top 0.4: 41.75,49.53 U10.1
  Top 0.508: R96.P$2 40.77,47.3 | C17.P$2 42.87,47.95 42.55,47.62 C16.P$1 41.75,48.92 41.75,49.53
N$15
  Top 0.508: U6.16 82.55,38.48 | 82.55,38.48 84.14,38.48 D3.C | C37.P$1 82.55,38.48
N$16
  Top 0.508: U7.15 102.87,35.75 R7.P$1
N$17
  Top 0.508: Q8.G 93.24,33.29 arc45 R8.P$2
N$18
  Top 0.4: 37.25,49.53 U10.8
  Top 0.508: R97.P$2 38.23,47.3 C16.P$2 | C16.P$2 37.25,48.92 37.25,49.53 | C32.P$1 36.51,47.95 36.83,47.62 C16.P$2
N$19
  Top 0.508: 104.2,38.42 U7.16 106.68,38.48 | 106.68,38.48 108.28,38.48 D4.C | C38.P$1 106.68,38.48
N$20
  Top 0.508: Q5.G 79.27,33.29 arc45 R5.P$2
N$21
  Top 0.152: Q1.G 31.11,30.27
  Top 0.508: Q1.G 31.01,33.09 arc-45 R1.P$2
N$22
  Top 0.508: Q3.G 55.14,33.29 arc45 R3.P$2
N$23
  Top 0.508: Q7.G 103.4,33.29 arc45 R7.P$2
N$24
  Top 0.508: U4.10 24.13,36.2 23.18,35.24 R2.P$1
N$25
  Top 0.508: U5.10 48.26,36.2 47.3,35.24 R4.P$1
N$26
  Top 0.508: U6.10 72.39,36.2 71.44,35.24 R6.P$1
N$27
  Top 0.508: U7.10 96.52,36.2 95.56,35.24 R8.P$1
N$28
  pour Top (no thermals): 64.89,3.42 65.29,3.82 arc45 66.17,5.94 66.17,17.2 arc45 65.39,19.06 arc45 63.27,19.94 58.55,19.94 58.55,6.07 arc45 59.43,3.95 59.95,3.42 arc45 62.08,2.54 62.77,2.54 arc45
N$29
  pour Top (no thermals): 56.12,2.15 56.91,2.93 arc45 57.78,5.05 57.78,5.11 arc45 56.91,7.23 52.95,11.19 arc45 50.83,12.06 50.65,12.06 arc-45 48.52,12.94 42.03,19.44 arc45 39.91,20.32 34.92,20.32 34.92,13.94 arc45 35.8,11.82 45.48,2.15 arc45 47.6,1.27 54,1.27 arc45
N$30
  Top 0.2: U$10.VBUS 84.78,91.11 86,89.9 86,89.38 85.63,89.01 83.86,89.01 D5.4 81.24,87.86 R12.P$1
N$33  (1 unrouted)
N$34
  Top 0.2: U9.9 75.64,86.11 R11.P$2
N$35
  Top 0.2: U9.16 72.78,89.28 73.22,89.72 73.22,93.47 C26.P$1
N$38
  Top 0.2: U1.60 69.03,63.2 69.72,63.9 70.56,63.9 R15.P$2
N$39
  Top 0.2: U1.59 69.15,62.8 69.85,63.5 72.07,63.5 R16.P$2
N$40
  Top 0.508: D4.A 108.21,42.87 R31.P$2
N$41
  Top 0.2: U12.4 69.46,58.77 67.41,58.77 66.81,59.37 U1.51
N$42
  Top 0.2: U1.50 66.41,58.69 67.31,57.78 R27.P$2
N$43
  Top 0.508: D3.A 84.08,42.87 R30.P$2
N$44  (1 unrouted)
N$45  (2 unrouted)
N$46  (2 unrouted)
N$47  (2 unrouted)
N$48
  Top 0.508: D2.A 59.95,42.87 R29.P$2
N$49
  Top 0.508: D1.A 35.82,42.87 R28.P$2
N$50  (1 unrouted)
  Top 0.2: R36.P$1 58.75,69.2 U1.16
N$51  (1 unrouted)
  Top 0.2: R37.P$1 58.55,68.4 U1.18
N$52
  Top 0.2: U1.17 52.6,68.8 R32.P$1 R33.P$2
N$53  (via drill 0.3)
  Top 0.2: v53.34,71.12 52.7,71.75 R35.P$2 R34.P$1 | v59.69,67.77 59.92,68 U1.19
  Bottom 0.2: v53.34,71.12 56.69,67.77 v59.69,67.77
N$54
  Top 0.2: U1.20 60.63,67.6 60.02,66.98 60,66.98 59.69,66.67 59.69,64.39 58.99,63.69 34.99,63.69 22.6,51.3 13.34,51.3 D8.P$3 9.53,46.04 C71.P$1 | C71.P$1 R38.P$1 | R39.P$2 C71.P$1
  Top 0.508: R39.P$2
N$55
  Top 0.508: R98.P$1 64.01,42.74 64.01,25.27 60.71,21.97 58.59,21.97 56.64,20.02 56.64,17.65 57.78,16.51 R10.SENSE-
N$56
  Top 0.508: R10.SENSE+ 54.61,16.51 55.75,17.65 55.75,20.32 58.29,22.86 60.33,22.86 63.12,25.65 63.12,42.61 R99.P$1
N$57
  Top 0.508: R99.P$2 62.23,47.3 C33.P$2 | C33.P$2 61.25,48.92 U11.8 | C33.P$2 60.77,47.62 60.45,47.95 C53.P$1
N$58
  Top 0.508: C33.P$1 65.75,48.92 U11.1 | R98.P$2 64.77,47.3 C33.P$1 | C46.P$2 66.61,47.95 66.29,47.62 C33.P$1
N$59  (1 unrouted)
N$60  (2 unrouted)
N$61  (1 unrouted)
N$62  (1 unrouted)
N$63
  Top 0.2: D11.C 73.78,90.17 U9.14
N$64
  Top 0.2: D10.C 75.64,90.69 74.28,89.33 U9.13
N$65
  Top 0.2: D11.A R42.P$1
N$66
  Top 0.2: D10.A R43.P$1
N$67  (4 unrouted)
N$68
  Top 0.2: U9.20 70.49,87.11 69.85,87.75 69.85,89.94 JP6.1
N$69  (4 unrouted)
N$70  (4 unrouted)
N$71  (1 unrouted)
N$72  (1 unrouted)
N$73  (1 unrouted)
N$74  (4 unrouted)
N$75  (4 unrouted)
N$76  (1 unrouted)
N$77  (1 unrouted)
N$78  (1 unrouted)
N$79  (4 unrouted)
N$80  (4 unrouted)
N$81  (4 unrouted)
N$82
  Top 0.2: J7.2 28.3,125.05 R54.P$1
N$83
  Top 0.2: J7.3 R57.P$1
N$84
  Top 0.2: J7.4 26.3,125.05 R60.P$1
N$85  (4 unrouted)
N$86  (4 unrouted)
N$87  (4 unrouted)
N$88  (1 unrouted)
N$89  (1 unrouted)
N$90  (1 unrouted)
N$91  (4 unrouted)
N$92  (2 unrouted)
N$93  (2 unrouted)
N$94  (2 unrouted)
N$95  (2 unrouted)
N$96  (2 unrouted)
N$97  (1 unrouted)
N$98  (1 unrouted)
N$99  (1 unrouted)
N$100
  Top 0.2: U17.2 13.34,47.3 R88.P$1
N$101
  Top 0.2: JP2.1 68.35,88.52 70.26,86.61 U9.21
N$102
  Top 0.508: Q9.G 8.15,33.23 R87.P$2
N$103
  Top 0.508: R87.P$1 10.47,35.24 12.06,36.83 U17.6 U17.7
N$104  (2 unrouted)
N$105
  pour Top (no thermals): 12.32,31.75 12.32,26.29 7.11,26.29 7.11,31.75 arc90 4.45,29.08 4.45,27.03 arc45 5.7,24.01 8.09,21.62 arc-45 10.05,16.88 arc-50 6.91,10.2 arc-40 5.05,9.53 arc45 2.93,8.65 1.96,7.68 arc45 1.25,5.95 arc45 2.48,2.97 arc45 5.05,1.91 arc45 7.92,3.09 13.64,8.82 arc45 15.24,12.67 15.24,28.83 arc90
N$106
  Top 0.2: JP1.1 71.75,88.33 U9.18
N$108
  Top 0.2: JP7.1 68.6,86.11 U9.22
N$109
  Top 0.2: JP5.1 71.78,81.71 U9.1
N$110
  Top 0.2: JP4.1 70.14,85.61 U9.23
N$111  (via drill 0.3 pad 0.6)
  Top 0.2: JP3.1 v69.22,81.28 | U9.24 70.5,85.11 v69.85,84.45
  Bottom 0.2: v69.22,81.28 69.85,81.92 v69.85,84.45
PWM_IN  (3 unrouted)
PWM_UX1_H
  Top 0.2: U4.1 R17.P$2 31.75,52.07 37.21,57.53 60.2,57.53 62.01,59.34 U1.39
PWM_UX1_L
  Top 0.2: U1.40 62.41,59.04 60.39,57.02 37.47,57.02 33.02,52.58 33.02,46.99 32.38,46.35 31.11,46.35 30.48,46.99 U4.2 30.48,51.12 R18.P$2
PWM_VX2_H
  Top 0.2: U1.41 62.8,58.74 55.88,51.81 R19.P$2 55.88,49.91 U5.1
PWM_VX2_L
  Top 0.152: 54.61,46.99 U5.2
  Top 0.2: 54.61,46.99 55.24,46.35 56.52,46.35 57.28,47.12 57.28,52.59 63.2,58.51 U1.42 | R20.P$2 54.61,51.12 U5.2
PWM_WY1_H
  Top 0.2: U1.46 64.81,57.12 66.93,54.99 80.26,54.99 81.28,53.98 81.28,49.15 U6.1 R21.P$2
PWM_WY1_L
  Top 0.2: U1.47 65.2,57.35 67.08,55.47 80.49,55.47 81.92,54.05 81.92,47.62 80.64,46.35 79.38,46.35 78.74,46.99 U6.2 78.74,51.12 R22.P$2
PWM_Y2_H
  Top 0.2: U1.48 65.61,57.58 67.23,55.95 80.7,55.95 81.41,55.24 104.14,55.24 105.41,53.98 105.41,49.15 U7.1 R23.P$2
PWM_Y2_L
  Top 0.2: U1.49 66.01,57.86 67.44,56.43 80.98,56.43 81.66,55.75 104.27,55.75 106.05,53.98 106.05,47.62 104.78,46.35 103.5,46.35 102.87,46.99 U7.2 102.87,51.12 R24.P$2
REF_H  (1 unrouted)
  Top 0.2: U1.68 68.43,66.4 68.88,66.85 69.06,66.85
REF_L  (1 unrouted)
  Top 0.2: 69.23,66.52 69.02,66.52 68.5,66 U1.67
REF_R  (1 unrouted)
  Top 0.2: U1.69 68.37,66.8 68.75,67.18 69.08,67.18
SCK  (via drill 0.3 pad 0.6)
  Top 0.2: U1.7 64.81,81.36 v66.06,82.61 68.98,82.61 70.71,80.89 71.74,80.89 JP5.2 | v60.55,94.45 J16.2
  Bottom 0.2: v66.06,82.61 66.67,83.23 66.67,84.45 60.55,90.58 v60.55,94.45
STEP  (3 unrouted)
UX1
  Top 0.508: Q2.D4 25.94,30.39 26.04,30.48 26.04,33.02 29.21,36.2 U4.14 29.21,40.64 30.48,41.91 32.7,41.91 C34.P$2
  pour Top (no thermals): 25.02,31.75 25.02,26.29 19.81,26.29 19.81,31.75 arc90 17.14,29.08 17.14,24.63 arc45 19.29,19.44 24.65,14.09 arc45 26.77,13.21 29.84,13.21 29.84,18.7 arc-45 30.72,20.82 33.92,24.01 arc45 34.8,26.13 34.8,31.75 31.62,31.75 31.62,29.21 30.35,29.21 30.35,26.29 26.92,26.29 26.92,31.75
VBUS
  Top 0.2: R13.P$1 R12.P$2 80.59,85.61 U9.8
VX2
  Top 0.508: Q4.D4 50.07,30.39 50.16,30.48 50.16,33.02 53.34,36.2 U5.14 53.34,40.64 54.61,41.91 56.83,41.91 C35.P$2
  pour Top (no thermals): 49.15,31.75 49.15,26.29 43.94,26.29 43.94,31.75 arc90 41.27,29.08 41.27,24.63 arc45 43.42,19.44 48.91,13.96 arc45 51.03,13.08 53.72,13.08 53.72,18.44 arc-45 54.6,20.56 58.05,24.01 arc45 58.93,26.13 58.93,31.75 55.75,31.75 55.75,29.21 54.48,29.21 54.48,26.29 51.05,26.29 51.05,31.75
WY1
  Top 0.508: Q6.D4 74.2,30.39 74.3,30.48 74.3,33.02 77.47,36.2 U6.14 77.47,40.64 78.74,41.91 80.96,41.91 C37.P$2
  pour Top (no thermals): 73.28,31.75 73.28,26.29 68.07,26.29 68.07,31.75 arc90 65.41,29.08 65.41,26.49 arc45 66.18,24.63 arc-45 67.06,22.51 67.06,5.97 arc43 67.86,3.92 68.26,3.5 arc47 70.46,2.54 71.27,2.54 arc45 73.4,3.42 73.8,3.82 arc45 74.68,5.94 arc-45 75.59,8.16 81.64,14.2 arc45 83.06,17.63 83.06,31.75 79.88,31.75 79.88,29.21 78.61,29.21 78.61,26.29 75.06,26.29 75.18,31.75
Y2
  Top 0.508: Q8.D4 98.42,30.82 98.42,33.02 101.6,36.2 U7.14 101.6,40.64 102.87,41.91 105.09,41.91 C38.P$2
  pour Top (no thermals): 97.41,31.75 97.41,26.29 92.2,26.29 92.2,31.75 arc90 88.27,27.81 88.27,20.96 arc-45 87.21,18.41 76.87,8.07 arc45 75.56,4.93 arc45 76.44,2.8 77.1,2.15 arc45 79.22,1.27 83.21,1.27 arc45 85.33,2.15 106.31,23.12 arc45 107.19,25.25 107.19,31.75 104.01,31.75 104.01,29.21 102.74,29.21 102.74,26.29 99.31,26.29 99.31,31.75